# EAGLE design PartiBadge (EAGLE 8.7.1)
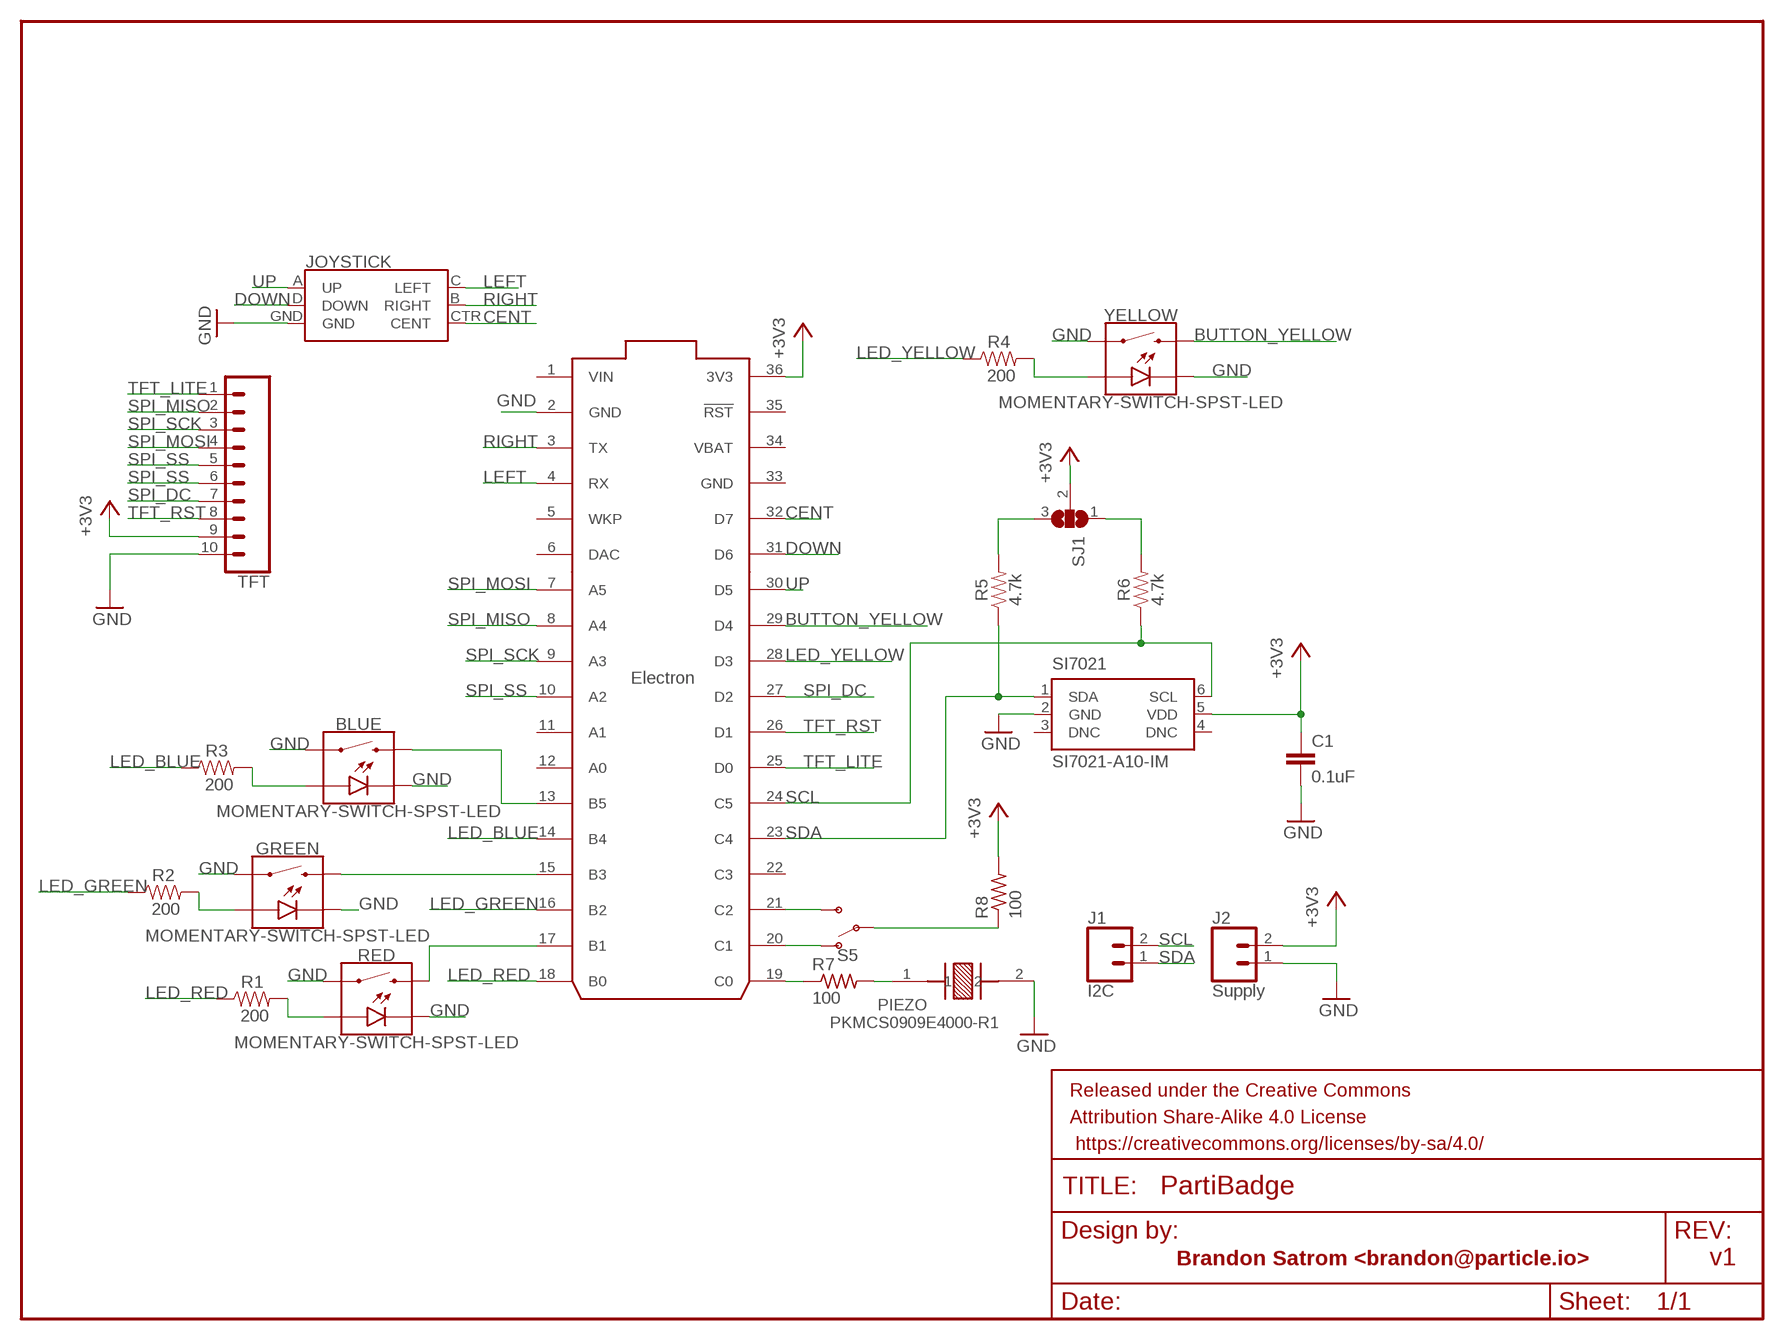
[diagram p0: schematic, sheet 1]

## Parts
BLUE  MOMENTARY-SWITCH-SPST-LED  MOMENTARY-SWITCH-SPST-LED-PTH-12MM-KIT  [TACTILE_SWITCH_LED_PTH_12MM_KIT]
C1  0.1uF  0.1UF-0603-25V-(+80/-20%)  [0603]
ELECTRON  ELECTRON_WITH_HEADERS  [ELECTRON]
GREEN  MOMENTARY-SWITCH-SPST-LED  MOMENTARY-SWITCH-SPST-LED-PTH-12MM-KIT  [TACTILE_SWITCH_LED_PTH_12MM_KIT]
J1  I2C  CONN_02  [1X02]
J2  Supply  CONN_02  [1X02]
JOYSTICK  JOYSTICK_MINI  [JOYSTICK_MINI]
PARTIFRAME  FRAME-LETTERNO_PACKAGE  [DUMMY]
PIEZO  PKMCS0909E4000-R1  [XDCR_PKMCS0909E4000-R1]
R1  200  RESISTOR1206  [1206]
R2  200  RESISTOR1206  [1206]
R3  200  RESISTOR1206  [1206]
R4  200  RESISTOR1206  [1206]
R5  4.7k  4.7KOHM-0603-1/10W-1%  [0603]
R6  4.7k  4.7KOHM-0603-1/10W-1%  [0603]
R7  100  R-US_M0805  [M0805]
R8  100  R-US_M0805  [M0805]
RED  MOMENTARY-SWITCH-SPST-LED  MOMENTARY-SWITCH-SPST-LED-PTH-12MM-KIT  [TACTILE_SWITCH_LED_PTH_12MM_KIT]
S5  SWITCH-SPDT-PTH-11.6X4.0MM  [SWITCH_SPDT_PTH_11.6X4.0MM]
SI7021  SI7021-A10-IM  [DFN6-3X3]
SJ1  SJ2W  [SJ_2]
TFT  CONN_10NO_SILK_PTH_FEMALE  [1X10_NO_SILK]
YELLOW  MOMENTARY-SWITCH-SPST-LED  MOMENTARY-SWITCH-SPST-LED-PTH-12MM-KIT  [TACTILE_SWITCH_LED_PTH_12MM_KIT]

## Nets
3V3: C1.1 ELECTRON.36(3V3) J2.2 R8.2 SI7021.5(VDD) SJ1.2 TFT.9 ; supply symbol labelled +3V3
BUTTON_YELLOW: ELECTRON.29(D4) YELLOW.2
CENT: ELECTRON.32(D7) JOYSTICK.CTR(CENT)
DOWN: ELECTRON.31(D6) JOYSTICK.D(DOWN)
GND: BLUE.4 BLUE.C C1.2 ELECTRON.2(GND) GREEN.4 GREEN.C J2.1 JOYSTICK.GND PIEZO.2 RED.4 RED.C SI7021.2(GND) TFT.10 YELLOW.4 YELLOW.C
LED_BLUE: ELECTRON.14(B4) R3.1
LED_GREEN: ELECTRON.16(B2) R2.1
LED_RED: ELECTRON.18(B0) R1.1
LED_YELLOW: ELECTRON.28(D3) R4.1
LEFT: ELECTRON.4(RX) JOYSTICK.C(LEFT)
N$1: ELECTRON.19(C0) R7.1
N$2: ELECTRON.20(C1) S5.1(O)
N$3: ELECTRON.21(C2) S5.3(S)
N$4: R1.2 RED.A
N$5: ELECTRON.17(B1) RED.2
N$6: ELECTRON.15(B3) GREEN.2
N$7: GREEN.A R2.2
N$8: BLUE.A R3.2
N$9: BLUE.2 ELECTRON.13(B5)
N$10: R4.2 YELLOW.A
N$11: R5.2 SJ1.3
N$12: R6.2 SJ1.1
N$13: PIEZO.1 R7.2
N$14: R8.1 S5.2(P)
RIGHT: ELECTRON.3(TX) JOYSTICK.B(RIGHT)
SCL: ELECTRON.24(C5) J1.2 R6.1 SI7021.6(SCL)
SDA: ELECTRON.23(C4) J1.1 R5.1 SI7021.1(SDA)
SPI_DC: ELECTRON.27(D2) TFT.7
SPI_MISO: ELECTRON.8(A4) TFT.2
SPI_MOSI: ELECTRON.7(A5) TFT.4
SPI_SCK: ELECTRON.9(A3) TFT.3
SPI_SS: ELECTRON.10(A2) TFT.5 TFT.6
TFT_LITE: ELECTRON.25(D0) TFT.1
TFT_RST: ELECTRON.26(D1) TFT.8
UP: ELECTRON.30(D5) JOYSTICK.A(UP)
Unconnected: ELECTRON.5(WKP) ELECTRON.6(DAC) ELECTRON.11(A1) ELECTRON.12(A0) ELECTRON.22(C3) ELECTRON.35(!RST) SI7021.3(DNC) SI7021.4(DNC)

## Notes on the sheet
- Brandon Satrom <brandon@particle.io> | v1

## Power pins joined to a net without a drawn wire
GND: ELECTRON.33(GND)
VBAT: ELECTRON.34(VBAT)
VIN: ELECTRON.1(VIN)

## Library data of the parts
BLUE GREEN RED YELLOW = SparkFun-Switches:MOMENTARY-SWITCH-SPST-LED: Momentary Switch (Pushbutton) - SPST - w/ LED Normally-open (NO) SPST momentary switches (buttons, pushbuttons), with a built-in LED. Variants PTH-CHERRY - Cherry MX Switch Cherry MX Keyswitches are top-of-the-line mechanical keyboard switches. They’re satisfyingly “clicky”, reliable up to tens-of-millions of key presses, and a standard in gaming and programming keyboards across the globe. This ‘blue’ version Cherry MX Switch is favored by most due to its secondary internal actuator making it less likely to “double-tap.” If you are looking for a noticeably audible and high-quality key switch, this is the perfect option for you! Cherry MX Switch <https://www.sparkfun.com/products/13834> (COM-13834) Cherry MX Switch Breakout <https://www.sparkfun.com/products/13773> (BOB-13773) PTH-12MM and PTH-12MM-KIT - 12mm Illuminated LED KIT variant is for soldering kits. There is no tStop (covering up the top side of the pads with mask). This helps the beginner see which side they should be soldering too. LED Tactile Button Breakout <https://www.sparkfun.com/products/10467> (BOB-10467) LED Tactile Button - Red <https://www.sparkfun.com/products/10442> (COM-10442) LED Tactile Button - Blue <https://www.sparkfun.com/products/10443> (COM-10443) LED Tactile Button - Green <https://www.sparkfun.com/products/10440> (COM-10440) LED Tactile Button - Orange <https://www.sparkfun.com/products/10441> (COM-10441) LED Tactile Button - White <https://www.sparkfun.com/products/10439> (COM-10439); PROD_ID: SWCH-11758; SF_SKU: COM-10442
C1 = SparkFun-Capacitors:0.1UF: 0.1µF ceramic capacitors A capacitor is a passive two-terminal electrical component used to store electrical energy temporarily in an electric field.; PROD_ID: CAP-00810
ELECTRON = Particle-Devices:ELECTRON: Particle Electron footprint
J1 J2 = SparkFun-Connectors:CONN_02: Multi connection point. Often used as Generic Header-pin footprint for 0.1 inch spaced/style header connections On any of the 0.1 inch spaced packages, you can populate with these: Break Away Headers - Straight <https://www.sparkfun.com/products/116> (PRT-00116) Break Away Male Headers - Right Angle <https://www.sparkfun.com/products/553> (PRT-00553) Female Headers <https://www.sparkfun.com/products/115> (PRT-00115) Break Away Headers - Machine Pin <https://www.sparkfun.com/products/117> (PRT-00117) Break Away Female Headers - Swiss Machine Pin <https://www.sparkfun.com/products/743> (PRT-00743) For SCREWTERMINALS and SPRING TERMINALS visit here: Screw Terimnals on SparkFun.com <https://www.sparkfun.com/search/results?term=Screw+Terminals> (5mm/3.5mm/2.54mm spacing) This device is also useful as a general connection point to wire up your design to another part of your project. Our various solder wires solder well into these plated through hole pads. Hook-Up Wire - Assortment (Stranded, 22 AWG) <https://www.sparkfun.com/products/11375> (PRT-11375) Hook-Up Wire - Assortment (Solid Core, 22 AWG) <https://www.sparkfun.com/products/11367> (PRT-11367) View the entire wire category on our website here <https://www.sparkfun.com/categories/141> Special notes: Molex polarized connector foot print use with: PRT-08233 with associated crimp pins and housings. 2.54_SCREWTERM for use with PRT-10571. 3.5mm Screw Terminal footprints for PRT-08084 5mm Screw Terminal footprints for use with PRT-08432
JOYSTICK = SparkFun-Switches:JOYSTICK_MINI: Small Tactile Joystick w/ Select Switch A 5-way tactile switch allows for a joystick-like interface in a very small package. Part #: 4UCON SF303GJ26 SparkFun Products 5-way Tactile Switch <https://www.sparkfun.com/products/10063> (COM-10063) Used on SparkFun Block for Intel® Edison - OLED <https://www.sparkfun.com/products/13035> (DEV-13035) Used on CAN-BUS Shield <https://www.sparkfun.com/products/13262> (DEV-13262); PROD_ID: SWCH-09905; SF_SKU: COM-10063
PARTIFRAME = SparkFun-Aesthetics:FRAME-LETTER: Schematic Frame - Letter Standard 8.5x11 US Letter frame; DESIGNER: Brandon Satrom; VERSION: v01
PIEZO = PKMCS0909E4000-R1:PKMCS0909E4000-R1: Audio Sounder Piezo Solder Pad Surface Mount; AVAILABILITY: Good; DESCRIPTION: Audio Sounder Piezo Solder Pad Surface Mount; MF: Murata; MP: PKMCS0909E4000-R1; PACKAGE: 2010 Murata; PRICE: 1.02 USD
R1-R4 = SparkFun-Resistors:RESISTOR: Generic Resistor Package
R5 R6 = SparkFun-Resistors:4.7KOHM: 4.7kΩ resistor A resistor is a passive two-terminal electrical component that implements electrical resistance as a circuit element. Resistors act to reduce current flow, and, at the same time, act to lower voltage levels within circuits. - Wikipedia; PROD_ID: RES-07857
R7 R8 = rcl:R-US_: RESISTOR, American symbol; SPICEPREFIX: R
S5 = SparkFun-Switches:SWITCH-SPDT: Single Pole, Double Throw (SPDT) Switch Single-pole, double-throw (SPDT) switch. Variant Overview SMD-AYZ0202 Surface Mount DPDT Switch <https://www.sparkfun.com/products/597> (COM-00597) Used on e.g. LilyPad Arduino USB - ATmega32U4 Board <https://www.sparkfun.com/products/12049> PTH-11.6X4.0MM SPDT Mini Power Switch <https://www.sparkfun.com/products/102> (COM-00102) Used on e.g. SparkFun Simon Says - Through-Hole Soldering Kit <https://www.sparkfun.com/products/10547> (KIT-10547) PTH-11.6X4.0MM-KIT KIT version of SPDT Mini Power Switch - Simplifies soldering by removing tStop of switch pins - only one side can be soldered. PTH-11.6X4.0MM-LOCK LOCK version of SPDT Mini Power Switch - Offset pins hold switch in place for easier soldering. SMD-RIGHT-ANGLE Surface Mount Right Angle Switch <https://www.sparkfun.com/products/10860> (COM-10860) Used on e.g. SparkFun ESP8266 Thing <https://www.sparkfun.com/products/13231>; PROD_ID: SWCH-08261; SF_SKU: COM-00102
SI7021 = si70xx-10:SI7021-*: I2C Humidity and Temperature Sensor Source: http://www.silabs.com/Support%20Documents/TechnicalDocs/Si7021.pdf; MF: Silicon Labs; MPN: Si7021-A10-IM; OC_FARNELL: 2422573; OC_NEWARK: 55X3113
SJ1 = jumper:SJ2W: SMD solder JUMPER
TFT = SparkFun-Connectors:CONN_10: Multi connection point. Often used as Generic Header-pin footprint for 0.1 inch spaced/style header connections On any of the 0.1 inch spaced packages, you can populate with these: Break Away Headers - Straight <https://www.sparkfun.com/products/116> (PRT-00116) Break Away Male Headers - Right Angle <https://www.sparkfun.com/products/553> (PRT-00553) Female Headers <https://www.sparkfun.com/products/115> (PRT-00115) Break Away Headers - Machine Pin <https://www.sparkfun.com/products/117> (PRT-00117) Break Away Female Headers - Swiss Machine Pin <https://www.sparkfun.com/products/743> (PRT-00743) Arduino Stackable Header - 10 Pin <https://www.sparkfun.com/products/11376> (PRT-11376) For SCREWTERMINALS and SPRING TERMINALS visit here: Screw Terimnals on SparkFun.com <https://www.sparkfun.com/search/results?term=Screw+Terminals> (5mm/3.5mm/2.54mm spacing) This device is also useful as a general connection point to wire up your design to another part of your project. Our various solder wires solder well into these plated through hole pads. Hook-Up Wire - Assortment (Stranded, 22 AWG) <https://www.sparkfun.com/products/11375> (PRT-11375) Hook-Up Wire - Assortment (Solid Core, 22 AWG) <https://www.sparkfun.com/products/11367> (PRT-11367) View the entire wire category on our website here <https://www.sparkfun.com/categories/141> Special notes: Molex polarized connector foot print use with SKU : PRT-08231 with associated crimp pins and housings. 1MM SMD Version SKU: PRT-10208 NOTES ON THE VARIANTS LOCK and LOCK_LONGPADS... This footprint was designed to help hold the alignment of a through-hole component (i.e. 6-pin header) while soldering it into place. You may notice that each hole has been shifted either up or down by 0.005 of an inch from it's more standard position (which is a perfectly straight line). This slight alteration caused the pins (the squares in the middle) to touch the edges of the holes. Because they are alternating, it causes a "brace" to hold the component in place. 0.005 has proven to be the perfect amount of "off-center" position when using our standard breakaway headers. Although looks a little odd when you look at the bare footprint, once you have a header in there, the alteration is very hard to notice. Also,if you push a header all the way into place, it is covered up entirely on the bottom side.; PROD_ID: CONN-11563; SPICEPREFIX: X

## Board
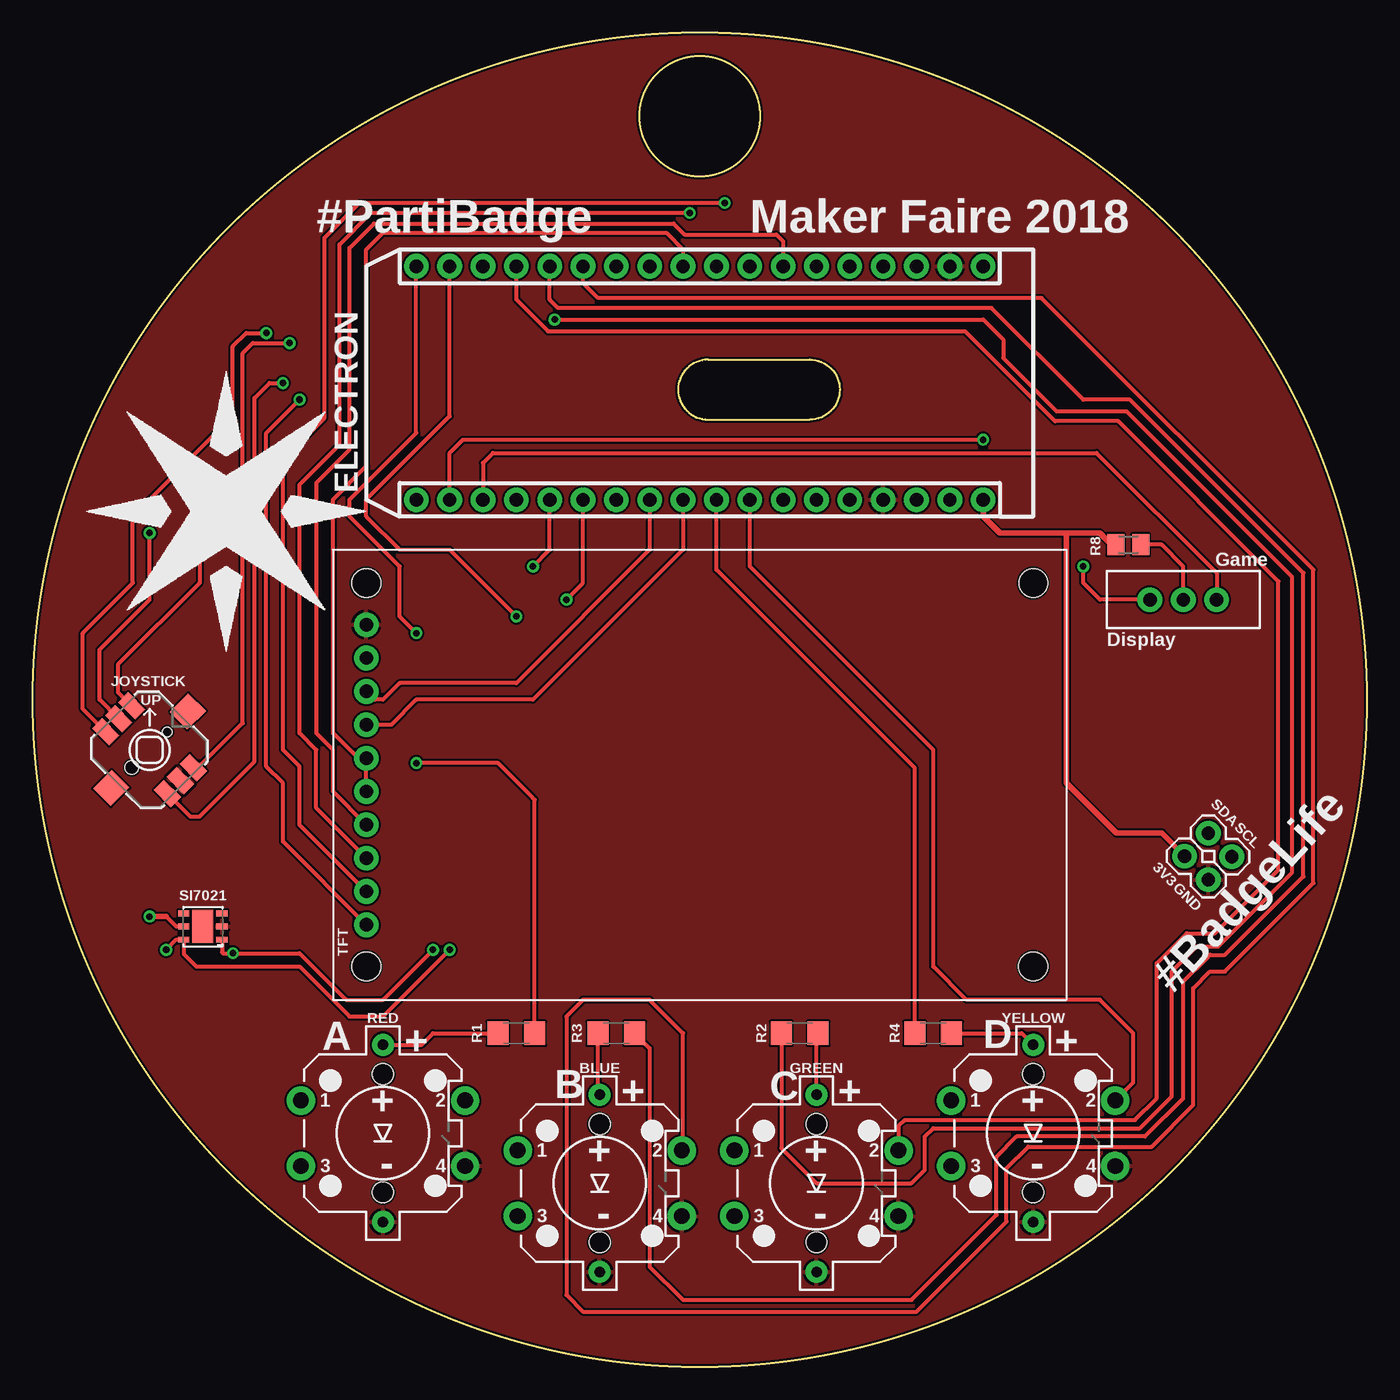
[diagram p1: board, top side]
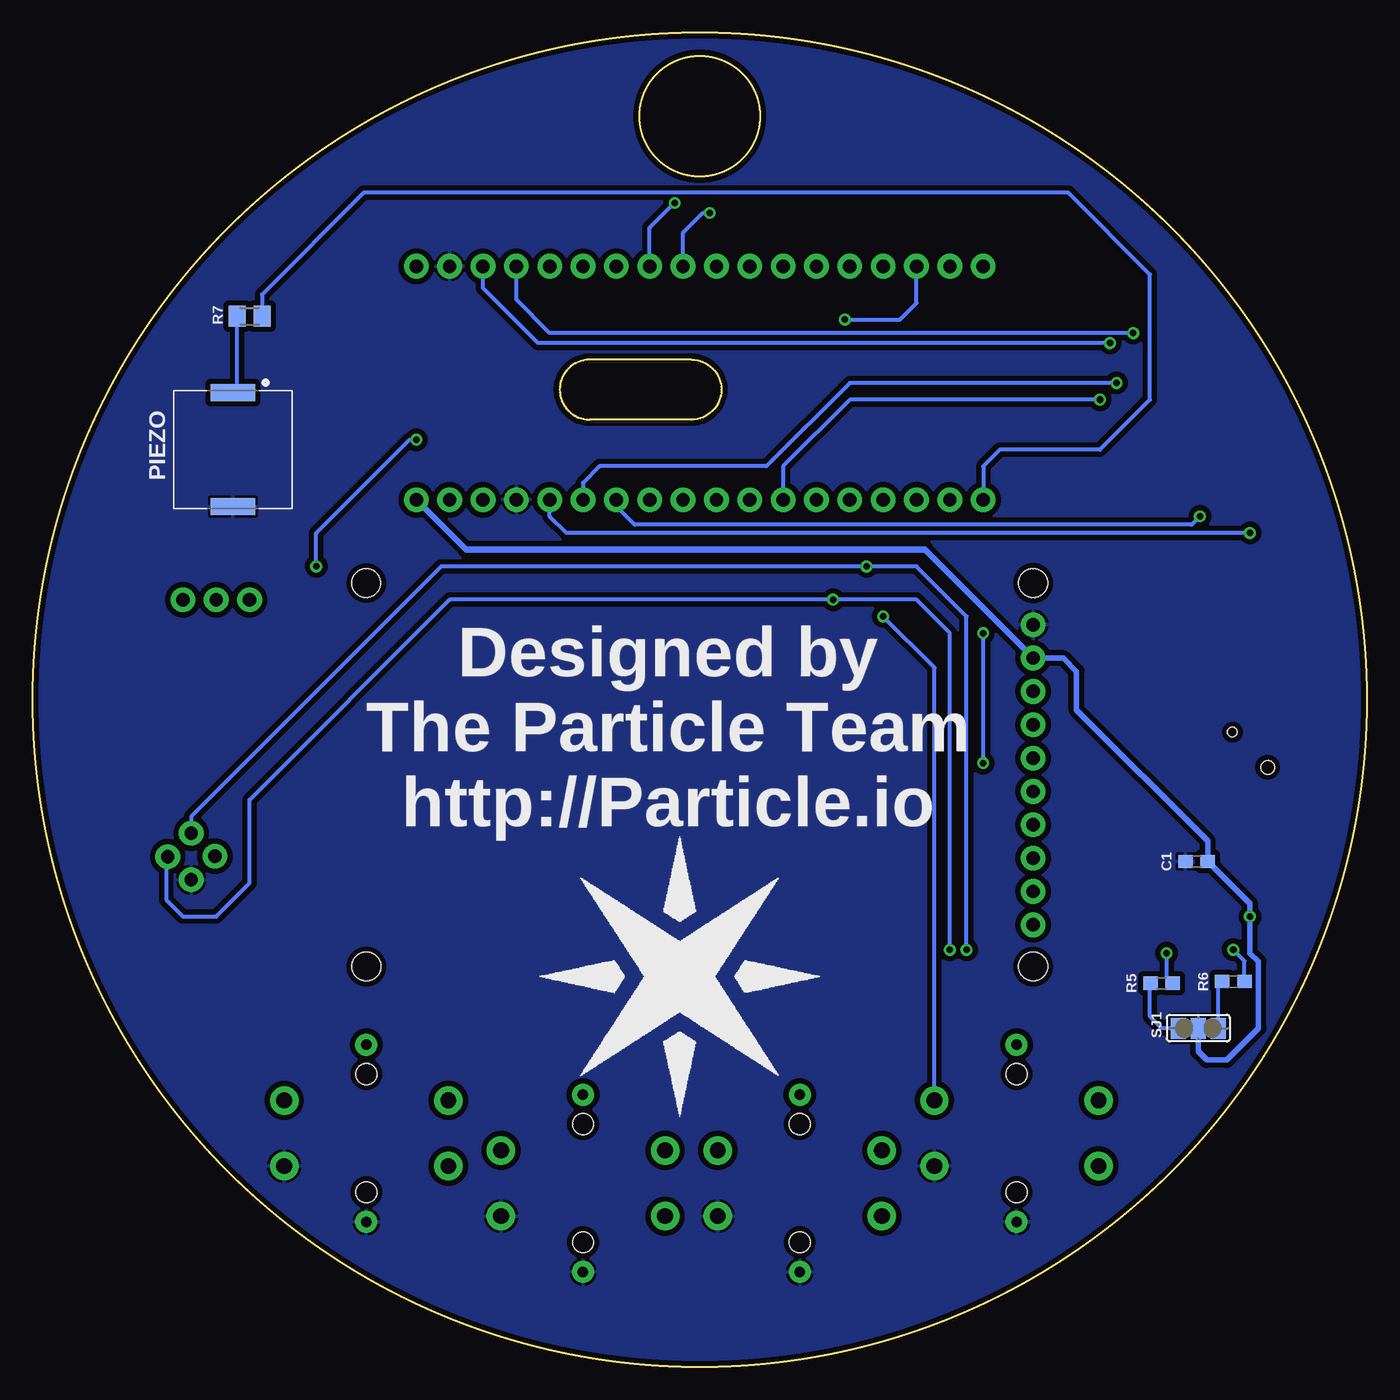
[diagram p2: board, bottom side, seen from below]

Size 101.6 x 101.6 mm. Coordinates in mm from the lower left corner, seen from the top.
Outline: 51.31,76.71 51.43,76.71
Outline: 51.43,76.71 59.18,76.71 arc-180 59.18,72.14 51.43,72.14 arc-180 51.43,76.71
Outline: circle at 50.8,50.8 radius 50.8
Outline: circle at 50.8,95.25 radius 4.58
Copper layers (1+2*15+16): Top 0.018mm / dielectric 0.195mm / Route2 0.035mm / dielectric 1.1mm / Route15 0.035mm / dielectric 0.195mm / Bottom 0.018mm
Design rules "spark-4layer": minimum track width 6mil, minimum drill 0.3mm, track to track 6mil, track to pad 6mil, pad to pad 6mil, via to via 6mil, smd to smd 6mil, copper to edge 6mil, drill to drill 6mil, minimum pad ring 12mil, minimum via ring 8mil, stop-mask expansion 4mil, vias tented up to drill 20mil, thermal gap 8mil
Holes 2.2 mm at 25.4,59.69 76.2,30.48 25.4,30.48
Holes 2.18 mm at 76.2,59.69

### Footprints (pad centres in the part's own frame; a part is rotated, then mirrored left to right if it is on the bottom)
TACTILE_SWITCH_LED_PTH_12MM_KIT = drill 1.2 pad 2.159: 1 -6.25,2.5; 2 6.25,2.5; 3 -6.25,-2.5; 4 6.25,-2.5 | drill 0.8 pad 1.676: A 0,6.75; C 0,-6.75 | hole 1.6: 0,4.5; 0,-4.5
0603 = smd 1.1 x 1: 1 -0.85,0; 2 0.85,0
ELECTRON = drill 1.016 pad 1.88: 1 1.27,46.99; 2 1.27,44.45; 3 1.27,41.91; 4 1.27,39.37; 5 1.27,36.83; 6 1.27,34.29; 7 1.27,31.75; 8 1.27,29.21; 9 1.27,26.67; 10 1.27,24.13; 11 1.27,21.59; 12 1.27,19.05; 13 1.27,16.51; 14 1.27,13.97; 15 1.27,11.43; 16 1.27,8.89; 17 1.27,6.35; 18 1.27,3.81; 19 19.05,3.81; 20 19.05,6.35; 21 19.05,8.89; 22 19.05,11.43; 23 19.05,13.97; 24 19.05,16.51; 25 19.05,19.05; 26 19.05,21.59; 27 19.05,24.13; 28 19.05,26.67; 29 19.05,29.21; 30 19.05,31.75; 31 19.05,34.29; 32 19.05,36.83; 33 19.05,39.37; 34 19.05,41.91; 35 19.05,44.45; 36 19.05,46.99
1X02 = drill 1.016 pad 1.88: 1 0,0; 2 2.54,0
JOYSTICK_MINI = smd 1.85 x 1.1: A -3.325,1.4; B 3.325,1.4; C -3.325,-1.4; CTR -3.325,0; D 3.325,-1.4; GND 3.325,0 | smd 1.9 x 2: NC 0,4.13; NC@0 0,-4.13 | hole 0.75: 0,1.9 | hole 1.05: 0,-1.9
XDCR_PKMCS0909E4000-R1 = smd 1.3 x 3.4: 1 -4.35,0; 2 4.35,0
1206 = smd 1.6 x 1.8: 1 -1.4,0; 2 1.4,0
M0805 = smd 1.3 x 1.6: 1 -0.95,0; 2 0.95,0
SWITCH_SPDT_PTH_11.6X4.0MM = drill 1.016 pad 1.88: 1 0,2.54; 2 0,0; 3 0,-2.54
DFN6-3X3 = smd 0.85 x 0.45: 1 -1.45,1; 2 -1.45,0; 3 -1.45,-1; 4 1.45,-1; 5 1.45,0; 6 1.45,1 | smd 1.6 x 2.5: EXP 0,0
SJ_2 = smd 1.168 x 1.6: 1 -1.524,0; 2 0,0; 3 1.524,0
1X10_NO_SILK = drill 1.016 pad 1.88: 1 0,0; 2 2.54,0; 3 5.08,0; 4 7.62,0; 5 10.16,0; 6 12.7,0; 7 15.24,0; 8 17.78,0; 9 20.32,0; 10 22.86,0

### Placement (x,y rotation side)
BLUE  43.18,13.97 0 top
C1  12.95,38.48 180 bottom
DRILEGEND  [DRILEGEND]  151,70.36 0 top  (outside the outline)
ELECTRON  25.4,85.09 270 top
GREEN  59.69,13.97 0 top
J1  89.53,40.64 315 top
J2  89.53,37.08 135 top
JOYSTICK  8.89,46.99 315 top
PARTIFRAME  -3.81,3.81 0 top  (outside the outline)
PIEZO  86.36,69.85 270 bottom
R1  36.83,25.4 180 top
R2  58.42,25.4 0 top
R3  44.45,25.4 180 top
R4  68.58,25.4 0 top
R5  15.62,29.21 180 bottom
R6  10.16,29.34 180 bottom
R7  85.09,80.01 180 bottom
R8  83.44,62.61 180 top
RED  26.67,17.78 0 top
S5  87.63,58.42 90 top
SI7021  12.95,33.53 180 top
SJ1  12.83,25.78 180 bottom
TFT  25.4,33.66 90 top
U$1  [SPARK#PNG]  52.32,29.72 90 bottom
U$2  [SPARK#PNG]  14.73,65.15 0 top
U$3  [FRAME_A_L]  -14.99,-7.87 0 top  (outside the outline)
YELLOW  76.2,17.78 0 top

### Tracks (layer width: path | path; a pad name or v marks a point on that pad's centre or on a via)
3V3  (via drill 0.5)
  Top 0.305: SI7021.5 10.92,33.53 10.16,34.29 | 87.63,38.99 J2.2 | R8.2 82.17,62.61
  Top 0.406: 10.16,34.29 v8.89,34.29 | ELECTRON.36 72.39,64.77 73.66,63.5 78.74,63.5 | 78.74,63.5 81.28,63.5 82.17,62.61 | J2.2 85.98,40.64 82.55,40.64 78.74,44.45 78.74,63.5
  Bottom 0.305: 24.76,53.98 TFT.9
  Bottom 0.406: TFT.9 33.65,62.23 | 68.58,62.23 ELECTRON.36 | SJ1.2 12.83,24 12.19,23.37 10.67,23.37 8.25,25.78 8.25,30.86 8.89,31.5 v8.89,34.29 8.89,35.27 C1.1 12.1,40.04 22.1,50.04 22.1,52.96 23.11,53.98 24.76,53.98
  Bottom 0.508: 33.65,62.23 68.58,62.23
BUTTON_YELLOW
  Top 0.305: ELECTRON.29 54.61,60.96 68.58,46.99 68.58,30.48 71.12,27.94 81.28,27.94 83.82,25.4 83.82,21.65 YELLOW.2
CENT  (via drill 0.5)
  Top 0.305: JOYSTICK.CTR 5.08,50.8 5.08,54.61 8.89,58.42 v8.89,63.5
  Top 0.406: JOYSTICK.CTR
  Bottom 0.305: v8.89,63.5 60.96,63.5 62.23,64.77 ELECTRON.32
DOWN  (via drill 0.5)
  Top 0.305: JOYSTICK.D 11.99,41.91 12.7,41.91 16.89,46.1 16.89,73.79 18.03,74.93 v19.05,74.93
  Bottom 0.305: v19.05,74.93 39.37,74.93 45.72,68.58 58.42,68.58 59.69,67.31 ELECTRON.31
GND
  pour Bottom (isolate 0.406): 50.8,101.6 arc-90 101.6,50.8 arc-90 50.8,0 arc-90 0,50.8 arc-90
  pour Top: 26.67,102.87 72.39,102.87 105.41,69.85 105.41,31.75 69.85,-3.81 33.02,-3.81 -6.35,35.56 -6.35,69.85
LED_BLUE
  Top 0.305: R3.1 46.99,24.26 46.99,7.62 49.53,5.08 66.93,5.08 73.41,11.56 73.41,16 74.93,17.53 84.71,17.53 87.63,20.45 87.63,29.34 89.41,31.12 89.66,31.37 90.8,31.37 96.77,37.34 96.77,60.45 83.57,73.66 80.01,73.66 73.02,80.65 40,80.65 39.37,81.28 ELECTRON.14
LED_GREEN  (via drill 0.5)
  Top 0.305: R2.1 57.02,16.64 59.69,13.97 66.93,13.97 67.94,14.99 67.94,17.53 68.58,18.16 84.33,18.16 86.74,20.57 86.74,30.1 88.65,32 90.3,32 95.88,37.59 95.88,60.2 83.31,72.77 77.98,72.77 73.91,76.84 73.91,78.23 72.39,79.76 v39.75,79.76
  Bottom 0.305: v39.75,79.76 35.56,79.76 34.29,81.03 ELECTRON.16
LED_RED  (via drill 0.5)
  Top 0.305: R1.1 38.23,43.18 38.1,43.31 35.43,45.97 v29.21,45.97 | v29.21,55.88 27.94,57.15 27.94,60.96 24.13,64.77 24.13,66.04 29.21,71.12 ELECTRON.18
  Bottom 0.305: v29.21,45.97 v29.21,55.88
LED_YELLOW
  Top 0.305: R4.1 67.18,45.59 52.07,60.7 ELECTRON.28
LEFT  (via drill 0.5)
  Top 0.305: JOYSTICK.C 3.81,50.09 3.81,55.88 7.62,59.69 7.62,64.77 15.24,72.39 15.24,77.72 16.26,78.74 v17.78,78.74
  Bottom 0.305: ELECTRON.4 64.77,81.28 62.23,78.74 v17.78,78.74
N$1
  Bottom 0.305: ELECTRON.19 29.21,68.58 27.94,69.85 20.32,69.85 16.51,73.66 16.51,83.19 22.73,89.41 76.39,89.41 84.14,81.66 R7.1
N$2  (via drill 0.5)
  Top 0.305: v80.01,60.96 80.01,59.69 81.28,58.42 S5.1 | ELECTRON.20 31.75,69.6 32.77,70.61 v72.39,70.61
  Bottom 0.305: v80.01,60.96 80.01,63.5 72.9,70.61 v72.39,70.61 72.26,70.61
N$3
  Top 0.305: ELECTRON.21 34.29,68.83 35.05,69.6 81.03,69.6 90.17,60.45 S5.3
N$4
  Top 0.305: RED.A 29.61,24.53 30.48,25.4 R1.2
N$5  (via drill 0.5)
  Top 0.305: ELECTRON.17 31.75,72.39 25.4,66.04 25.4,64.77 27.94,62.23 31.75,62.23 v36.83,57.15
  Bottom 0.305: RED.2 32.92,53.24 v36.83,57.15
N$6
  Top 0.305: ELECTRON.15 36.83,81.28 39.24,78.87 70.99,78.87 77.85,72.01 82.68,72.01 94.87,59.82 94.87,37.85 90.04,33.02 87.88,33.02 85.6,30.73 85.6,20.45 83.95,18.8 66.42,18.8 65.91,18.29 65.94,18.26 GREEN.2
N$7
  Top 0.305: GREEN.A 59.69,25.27 R2.2
N$8
  Top 0.305: BLUE.A 43.05,20.85 R3.2
N$9
  Top 0.305: 49.53,16.51 49.49,16.47 BLUE.2 49.39,16.51 | ELECTRON.13 41.91,82.55 43.05,81.41 76.83,81.41 97.54,60.71 97.54,36.83 90.8,30.1 89.66,30.1 88.39,28.83 88.39,19.94 85.22,16.76 75.82,16.76 74.17,15.11 74.17,11.05 67.31,4.19 41.91,4.19 40.64,5.46 40.64,26.67 41.91,27.94 46.99,27.94 49.53,25.4 49.53,16.57
  Top 0.406: BLUE.2 49.53,16.57
N$10
  Top 0.305: R4.2 75.33,25.4 YELLOW.A
N$11
  Bottom 0.305: R5.2 16.51,29.21 16.51,26.67 15.62,25.78 SJ1.3
N$12
  Bottom 0.305: SJ1.1 11.3,29.04 R6.2
N$13
  Bottom 0.305: PIEZO.1 86.04,74.52 R7.2
N$14
  Top 0.305: S5.2 87.63,60.96 85.98,62.61 R8.1
RIGHT  (via drill 0.5)
  Top 0.305: JOYSTICK.B 12.61,45.63 16,49.02 16,77.22 16.76,77.98 v19.56,77.98
  Bottom 0.305: ELECTRON.3 67.31,82.17 63.12,77.98 v19.56,77.98
SCL  (via drill 0.5)
  Top 0.305: v10.16,31.75 10.94,32.53 SI7021.6 | SI7021.6 11.43,32.45 | v31.75,31.75 26.67,26.67 24.13,26.67 20.32,30.48 12.45,30.48 11.5,31.42 SI7021.6 | v40.64,58.42 41.91,59.69 ELECTRON.24
  Bottom 0.305: R6.1 9.31,30.9 v10.16,31.75 | v31.75,31.75 31.75,55.88 34.29,58.42 v40.64,58.42 69.85,58.42 85.09,43.18 85.09,36.83 87.63,34.29 90.17,34.29 91.44,35.56 91.44,38.73 J1.2
SDA  (via drill 0.5)
  Top 0.305: 14.46,32.53 SI7021.1 14.4,31.57 14.48,31.5 v15.24,31.5 20.32,31.5 23.88,27.94 26.67,27.94 v30.48,31.75 | v38.1,60.96 39.37,62.23 ELECTRON.23
  Bottom 0.305: R5.1 15.24,29.68 v15.24,31.5 | v30.48,31.75 30.48,57.15 34.29,60.96 v38.1,60.96 70.48,60.96 89.53,41.91 J1.1
SPI_DC
  Top 0.305: ELECTRON.27 49.53,62.23 38.1,50.8 29.21,50.8 27.3,48.89 TFT.7
SPI_MISO  (via drill 0.5)
  Top 0.305: TFT.2 20.32,41.27 20.32,45.72 19.05,46.99 19.05,69.09 22.22,72.26 22.22,85.98 24.89,88.65 v52.7,88.65
  Bottom 0.305: v52.7,88.65 54.61,86.74 ELECTRON.8
SPI_MOSI
  Top 0.305: TFT.4 22.86,43.81 22.86,46.99 21.59,48.26 21.59,67.31 24.13,69.85 24.13,85.21 25.99,87.07 48.82,87.07 49.66,86.23 56.64,86.23 57.15,85.72 ELECTRON.7
SPI_SCK  (via drill 0.5)
  Top 0.305: TFT.3 21.59,42.55 21.59,46.99 20.32,48.26 20.32,67.18 23.37,70.23 23.37,85.47 25.78,87.88 v50.04,87.88
  Bottom 0.305: ELECTRON.9 52.07,86.36 50.55,87.88 v50.04,87.88
SPI_SS
  Top 0.305: TFT.5 TFT.6 24.76,46.35 22.86,48.26 22.86,66.04 25.4,68.58 25.4,85.09 26.67,86.36 48.26,86.36 49.53,85.09 ELECTRON.10
TFT_LITE  (via drill 0.5)
  Top 0.305: TFT.1 19.05,40 19.05,44.45 17.78,45.72 17.78,71.12 v20.32,73.66
  Bottom 0.305: ELECTRON.25 44.45,68.58 39.37,73.66 v20.32,73.66
TFT_RST
  Top 0.305: ELECTRON.26 46.99,62.23 36.83,52.07 27.94,52.07 26.67,50.8 26.03,50.8 TFT.8
UP  (via drill 0.5)
  Top 0.305: v12.7,64.77 12.7,59.69 6.48,53.47 6.48,51.38 JOYSTICK.A
  Bottom 0.305: v12.7,64.77 13.33,64.13 55.75,64.13 57.15,65.53 ELECTRON.30

### Text on the board
tPlace: #PartiBadge | Maker Faire 2018 | Game | Display | SDA | SCL | 3V3 | GND | #BadgeLife | D | A | B | C
bPlace: Designed by / The Particle Team / http://Particle.io
Measures: *NON PLATED * / *SLOT*
Reference: NOTES: | 1. | MATERIAL: MAKE FROM EPOXY GLASS (NEMA-GR-FR4, | SOLDERMASK COLOR -- MATTE BLACK) | 2 LAYERS | 2. | PLATING: | ENIG GOLD | Layer Stackup: | Top Silkscreen | Top Soldermask | Top Copper (1 Oz.) | 0.062" FR4 | Bottom Copper (1 Oz.) | Bottom Soldermask | Bottom Silkscreen
DrillLegend: LAYER-STACK
DrillLegend_01-16: 01-16
DrillLegend_01-20: 01-20